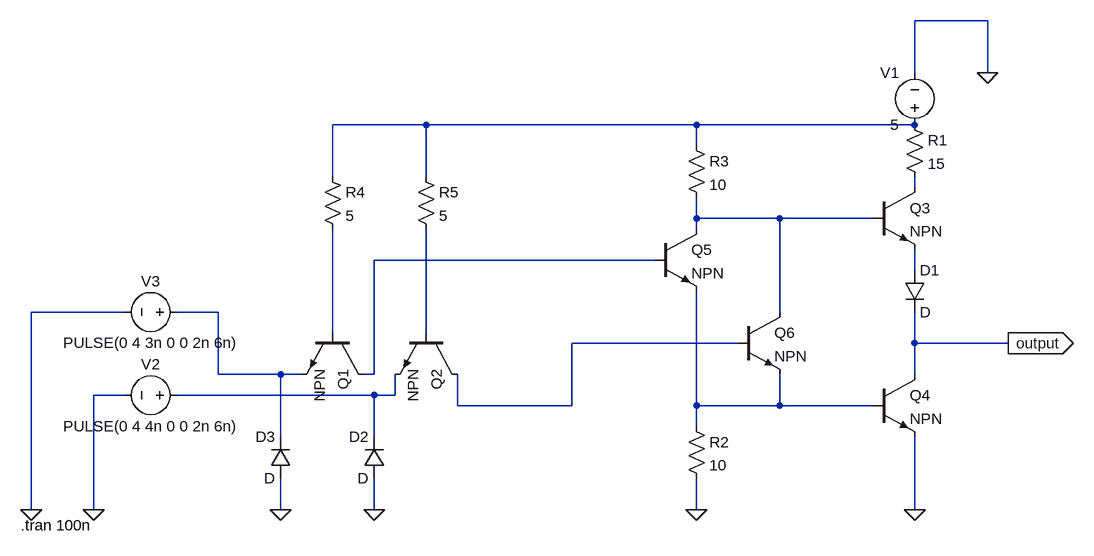
[diagram p0: schematic nor-tr-bi.asc]
nor-tr-bi.asc, the LTspice schematic file:
Version 4.1
SHEET 1 1048 744
WIRE 880 -320 768 -320
WIRE 768 -240 768 -320
WIRE 880 -240 880 -320
WIRE 16 -160 -128 -160
WIRE 432 -160 16 -160
WIRE 768 -160 432 -160
WIRE 432 -128 432 -160
WIRE -128 -80 -128 -160
WIRE 16 -80 16 -160
WIRE 768 -64 768 -80
WIRE 432 -16 432 -48
WIRE 560 -16 432 -16
WIRE 704 -16 560 -16
WIRE 432 0 432 -16
WIRE 368 48 -64 48
WIRE 768 64 768 32
WIRE -448 128 -592 128
WIRE -304 128 -368 128
WIRE 560 128 560 -16
WIRE -128 160 -128 0
WIRE 16 160 16 0
WIRE 496 176 240 176
WIRE 768 176 768 128
WIRE 912 176 768 176
WIRE -304 224 -304 128
WIRE -208 224 -304 224
WIRE -176 224 -208 224
WIRE -64 224 -64 48
WIRE -64 224 -80 224
WIRE 768 224 768 176
WIRE -448 256 -496 256
WIRE -64 256 -368 256
WIRE -32 256 -32 224
WIRE -32 256 -64 256
WIRE 64 272 64 224
WIRE 240 272 240 176
WIRE 240 272 64 272
WIRE 432 272 432 96
WIRE 560 272 560 224
WIRE 560 272 432 272
WIRE 704 272 560 272
WIRE 432 304 432 272
WIRE -208 320 -208 224
WIRE -64 320 -64 256
WIRE -592 432 -592 128
WIRE -496 432 -496 256
WIRE -208 432 -208 384
WIRE -64 432 -64 384
WIRE 432 432 432 384
WIRE 768 432 768 320
FLAG 880 -240 0
FLAG 768 432 0
FLAG 432 432 0
FLAG -64 432 0
FLAG -208 432 0
FLAG -496 432 0
FLAG -592 432 0
FLAG 912 176 output
IOPIN 912 176 Out
SYMBOL voltage 768 -144 R180
WINDOW 0 24 96 Left 2
WINDOW 3 24 16 Left 2
WINDOW 123 0 0 Left 0
WINDOW 39 0 0 Left 0
SYMATTR InstName V1
SYMATTR Value 5
SYMBOL npn -80 160 R90
SYMATTR InstName Q1
SYMBOL npn 64 160 R90
SYMATTR InstName Q2
SYMBOL npn 704 -64 R0
SYMATTR InstName Q3
SYMBOL npn 704 224 R0
SYMATTR InstName Q4
SYMBOL res 752 -176 R0
SYMATTR InstName R1
SYMATTR Value 15
SYMBOL res 416 288 R0
SYMATTR InstName R2
SYMATTR Value 10
SYMBOL diode 752 64 R0
SYMATTR InstName D1
SYMBOL diode -48 384 R180
WINDOW 0 24 64 Left 2
WINDOW 3 24 0 Left 2
SYMATTR InstName D2
SYMBOL diode -192 384 R180
WINDOW 0 24 64 Left 2
WINDOW 3 24 0 Left 2
SYMATTR InstName D3
SYMBOL voltage -352 256 R90
WINDOW 0 -32 56 VBottom 2
WINDOW 3 32 56 VTop 2
WINDOW 123 0 0 Left 0
WINDOW 39 0 0 Left 0
SYMATTR InstName V2
SYMATTR Value PULSE(0 4 4n 0 0 2n 6n)
SYMBOL voltage -352 128 R90
WINDOW 0 -32 56 VBottom 2
WINDOW 3 32 56 VTop 2
WINDOW 123 0 0 Left 0
WINDOW 39 0 0 Left 0
SYMATTR InstName V3
SYMATTR Value PULSE(0 4 3n 0 0 2n 6n)
SYMBOL res 416 -144 R0
SYMATTR InstName R3
SYMATTR Value 10
SYMBOL res -144 -96 R0
SYMATTR InstName R4
SYMATTR Value 5
SYMBOL res 0 -96 R0
SYMATTR InstName R5
SYMATTR Value 5
SYMBOL npn 368 0 R0
SYMATTR InstName Q5
SYMBOL npn 496 128 R0
SYMATTR InstName Q6
TEXT -608 456 Left 2 !.tran 100n

The netlist it stands for:
* nor-tr-bi.asc
V1 N001 0 5
Q1 N004 N007 N006 0 NPN
Q2 N009 N008 N010 0 NPN
Q3 N002 N003 N005 0 NPN
Q4 output N011 0 0 NPN
R1 N001 N002 15
R2 N011 0 10
D1 N005 output D
D2 0 N010 D
D3 0 N006 D
V2 N010 0 PULSE(0 4 4n 0 0 2n 6n)
V3 N006 0 PULSE(0 4 3n 0 0 2n 6n)
R3 N001 N003 10
R4 N001 N007 5
R5 N001 N008 5
Q5 N003 N004 N011 0 NPN
Q6 N003 N009 N011 0 NPN
.model D D
.lib standard.dio
.model NPN NPN
.model PNP PNP
.lib standard.bjt
.tran 100n
.backanno
.end